# Altium schematic sheet LCD.SchDoc
size A
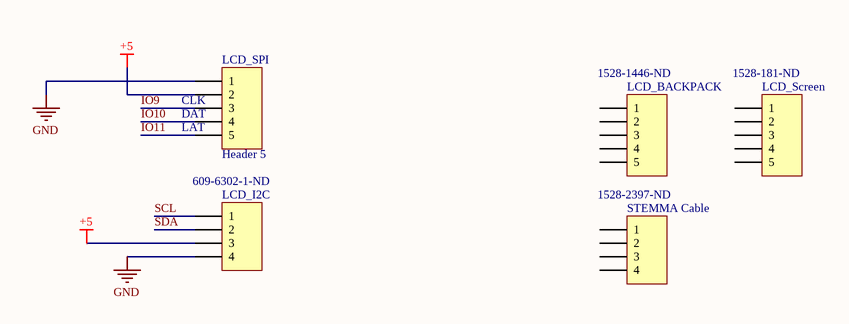
[diagram p0: LCD.SchDoc]

## Parts
LCD_BACKPACK  Supplier Part Number 1: 1528-1446-ND  [HDR1X5]  (mechanical)
LCD_I2C  Supplier Part Number 1: 609-6302-1-ND  [10147606-00004LF]
LCD_Screen  Supplier Part Number 1: 1528-181-ND  [HDR1X5]  (mechanical)
LCD_SPI  Header 5  [HDR1X5]
STEMMA_Cable  Supplier Part Number 1: 1528-2397-ND  [10147606-00004LF]  (mechanical)

## Nets
+5: LCD_I2C.3 LCD_SPI.2
GND: LCD_I2C.4 LCD_SPI.1
IO9: LCD_SPI.3
IO10: LCD_SPI.4
IO11: LCD_SPI.5
SCL: LCD_I2C.1
SDA: LCD_I2C.2

Not connected (* = marked no-connect by the designer): LCD_BACKPACK 1 2 3 4 5; LCD_Screen 1 2 3 4 5; STEMMA_Cable 1 2 3 4

## Notes on the sheet
- (near LCD_SPI) CLK
- (near LCD_SPI) DAT
- (near LCD_SPI) LAT

## Library data of the parts
LCD_BACKPACK = Header 5: I2C/Spi Character Lcd Backpack - Stemma Qt/Qwiic Rohs Compliant: Yes |Adafruit 292; Manufacturer: Adafruit Industries; Manufacturer Part Number: 292; Supplier 1: Digikey; RoHS: Yes; Category: Optoelectronics; Stock 1: 86; Pricing 1: 1=9.95 (USD); ComponentLink1URL: http://www.alliedelec.com/m/d/fbf915f4a11a953f4c276fdc61ad8095.pdf?src-supplier=Allied+Electronics; ComponentLink1Description: http://www.alliedelec.com/m/d/fbf915f4a11a953f4c276fdc61ad8095.pdf?src-supplier=Allied+Electronics; ComponentLink2URL: https://learn.adafruit.com/downloads/pdf/i2c-spi-lcd-backpack.pdf?src-supplier=Digikey; ComponentLink2Description: https://learn.adafruit.com/downloads/pdf/i2c-spi-lcd-backpack.pdf?src-supplier=Digikey
LCD_I2C = Header 4: Connector Shrouded Header 4 Position Right Angle Surface Mount T/R; Manufacturer: AMPHENOL ICC (FCI); Supplier 1: Digikey; Manufacturer Part Number: 10147606-00004LF; RoHS: No
LCD_Screen = Header 5: Standard LCD 16x2 + extras - white on blue | Adafruit Industries 181; Manufacturer Part Number: 181; Supplier 1: Digikey; Manufacturer: Adafruit Industries; RoHS: Yes; Stock 1: 47; Pricing 1: 1=9.95 (USD); ComponentLink1URL: https://cdn-shop.adafruit.com/datasheets/HD44780.pdf?src-supplier=Digikey; ComponentLink1Description: https://cdn-shop.adafruit.com/datasheets/HD44780.pdf?src-supplier=Digikey
LCD_SPI = Header 5: Header, 5-Pin; LatestRevisionDate: 17-Jul-2002; LatestRevisionNote: Re-released for DXP Platform.; Publisher: Altium Limited
STEMMA_Cable = Header 4: Holder; Fuse; Auto Blade; Mini; 500VAC; 30A; PC Pin Terminal; Nylon 4/6 Holder; Black; Manufacturer: Adafruit Industries; Manufacturer Part Number: 3568; Supplier 1: Digikey; RoHS: No; Stock 1: 325; Pricing 1: 1=0.75 (USD); ComponentLink1URL: https://media.digikey.com/pdf/Data%20Sheets/Adafruit%20PDFs/3568_Web.pdf?src-supplier=Digikey; ComponentLink1Description: https://media.digikey.com/pdf/Data%20Sheets/Adafruit%20PDFs/3568_Web.pdf?src-supplier=Digikey